# Altium schematic sheet Car_MCU.SchDoc: Wacky Vehicle MCU
size A3; DrawnBy: K. Carden, O. Anainga; Organization: Group 2; Address1: ECE Department; Address2: University of Canterbury; Address3: Christchurch 8041; Address4: New Zealand; Revision: 1; SheetNumber: 1; SheetTotal: 3; ImagePath: C:\Users\Public\Documents\Altium\AD23\Templates\UC_Templates\uc-logo.png
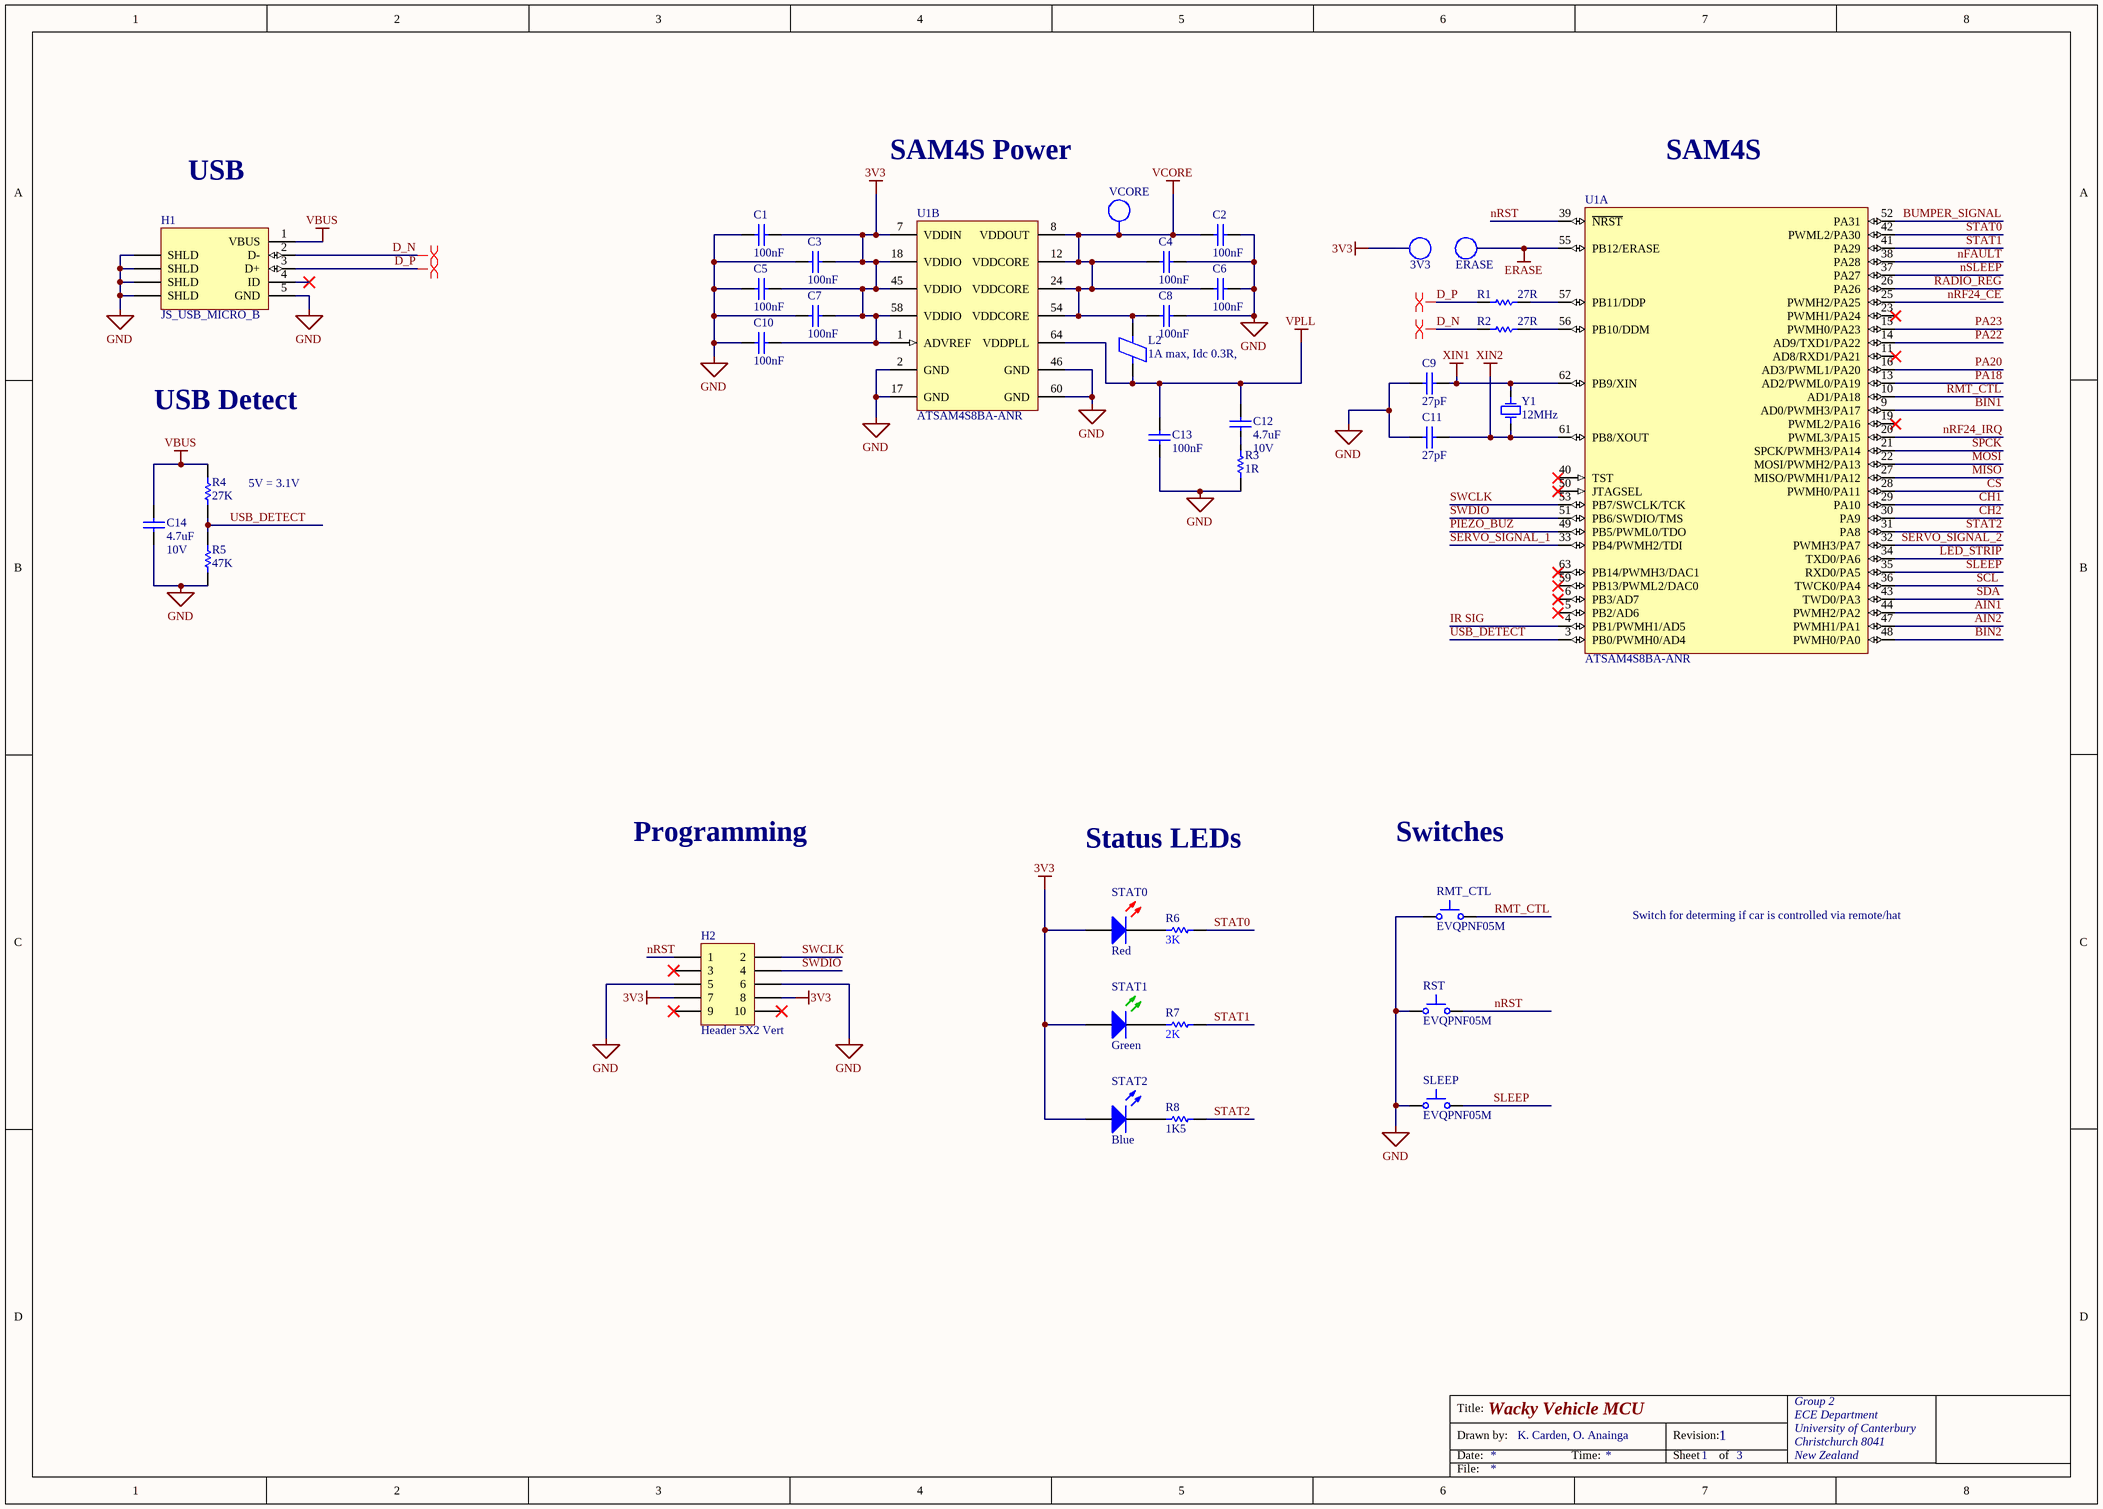
[diagram p0: Car_MCU.SchDoc]

## Parts
3V3  TP_0805  [TP_0805]  (value not drawn)
C1  100nF  [CAPC1608L]
C2  100nF  [CAPC1608L]
C3  100nF  [CAPC1608L]
C4  100nF  [CAPC1608L]
C5  100nF  [CAPC1608L]
C6  100nF  [CAPC1608L]
C7  100nF  [CAPC1608L]
C8  100nF  [CAPC1608L]
C9  27pF  [CAPC1608L]
C10  100nF  [CAPC1608L]
C11  27pF  [CAPC1608L]
C12  Max Voltage: 10V  [CAPC1608N]  (hidden comment: 4.7uF)
C13  100nF  [CAPC1608L]
C14  Max Voltage: 10V  [CAPC1608N]  (hidden comment: 4.7uF)
ERASE  TP_0805  [TP_0805]  (value not drawn)
H1  JS_USB_MICRO_B  [FCI_USB_10118194-0001LF]
H2  Header 5X2 Vert  [IDC2.54-V10D]
L2  1A max, Idc 0.3R,  [INDC3216L]
R1  27R  [RESC1608L]
R2  27R  [RESC1608L]
R3  1R  [RESC3216L]
R4  27K  [RESC1608L]
R5  47K  [RESC1608L]
R6  3K  [RESC1608L]
R7  2K  [RESC1608L]
R8  1K5  [RESC1608L]
RMT_CTL  EVQPNF05M  [EVQPNF05M]
RST  EVQPNF05M  [EVQPNF05M]
SLEEP  EVQPNF05M  [EVQPNF05M]
STAT0  Red  [WL-SMCW0603]
STAT1  Green  [WL-SMCW0603]
STAT2  Blue  [WL-SMCW0603]
U1  ATSAM4S8BA-ANR  [LQFP64_L]  (parts A,B of 2)
VCORE  VCORE  [TP_1206]  (value not drawn)  (no BOM)
Y1  12MHz  [6.0X3.5-4]

## Nets
3V3: 3V3.1(TP) C1.2 C3.2 C5.2 C7.2 C10.2 H2.7 H2.8 STAT0.2(A) STAT1.2(A) STAT2.2(A) U1.1(ADVREF) U1.7(VDDIN) U1.18(VDDIO) U1.45(VDDIO) U1.58(VDDIO)
ERASE: ERASE.1(TP) U1.55(PB12/ERASE)
GND: C1.1 C2.2 C3.1 C4.2 C5.1 C6.2 C7.1 C8.2 C9.1 C10.1 C11.1 C13.1 C14.1 H1.5(GND) H1.6(SHLD) H2.5 H2.6 R3.1 R5.1 RMT_CTL.1 RST.1 SLEEP.1 U1.2(GND) U1.17(GND) U1.46(GND) U1.60(GND)
VBUS: C14.2 H1.1(VBUS) R4.2
VCORE: C2.1 C4.1 C6.1 C8.1 L2.2 U1.8(VDDOUT) U1.12(VDDCORE) U1.24(VDDCORE) U1.54(VDDCORE) VCORE.1
VPLL: C12.2 C13.2 L2.1 U1.64(VDDPLL)
XIN1: C9.2 U1.62(PB9/XIN) Y1.3(OSC2)
XIN2: C11.2 U1.61(PB8/XOUT) Y1.1(OSC1)
AIN1: U1.44(PWMH2/PA2)
AIN2: U1.47(PWMH1/PA1)
BIN1: U1.9(AD0/PWMH3/PA17)
BIN2: U1.48(PWMH0/PA0)
BUMPER_SIGNAL: U1.52(PA31)
CH1: U1.29(PA10)
CH2: U1.30(PA9)
CS: U1.28(PWMH0/PA11)
D_N: H1.2(D-) R2.1
D_P: H1.3(D+) R1.1
IR SIG: U1.4(PB1/PWMH1/AD5)
LED_STRIP: U1.34(TXD0/PA6)
MISO: U1.27(MISO/PWMH1/PA12)
MOSI: U1.22(MOSI/PWMH2/PA13)
nFAULT: U1.38(PA28)
nRF24_CE: U1.25(PWMH2/PA25)
nRF24_IRQ: U1.20(PWML3/PA15)
nRST: H2.1 RST.2 U1.39(~{NRST})
nSLEEP: U1.37(PA27)
PA18: U1.13(AD2/PWML0/PA19)
PA20: U1.16(AD3/PWML1/PA20)
PA22: U1.14(AD9/TXD1/PA22)
PA23: U1.15(PWMH0/PA23)
PIEZO_BUZ: U1.49(PB5/PWML0/TDO)
RADIO_REG: U1.26(PA26)
RMT_CTL: RMT_CTL.2 U1.10(AD1/PA18)
SCL: U1.36(TWCK0/PA4)
SDA: U1.43(TWD0/PA3)
SERVO_SIGNAL_1: U1.33(PB4/PWMH2/TDI)
SERVO_SIGNAL_2: U1.32(PWMH3/PA7)
SLEEP: SLEEP.2 U1.35(RXD0/PA5)
SPCK: U1.21(SPCK/PWMH3/PA14)
STAT0: R6.2 U1.42(PWML2/PA30)
STAT1: R7.2 U1.41(PA29)
STAT2: R8.2 U1.31(PA8)
SWCLK: H2.2 U1.53(PB7/SWCLK/TCK)
SWDIO: H2.4 U1.51(PB6/SWDIO/TMS)
USB_DETECT: R4.1 R5.2 U1.3(PB0/PWMH0/AD4)
NetC12_1: C12.1 R3.2
NetR1_2: R1.2 U1.57(PB11/DDP)
NetR2_2: R2.2 U1.56(PB10/DDM)
NetR6_1: R6.1 STAT0.1(K)
NetR7_1: R7.1 STAT1.1(K)
NetR8_1: R8.1 STAT2.1(K)

Not connected (* = marked no-connect by the designer): H1 4(ID)*; H2 3* 9* 10*; U1 5(PB2/AD6)* 6(PB3/AD7)* 11(AD8/RXD1/PA21)* 19(PWML2/PA16)* 23(PWMH1/PA24)* 40(TST)* 50(JTAGSEL)* 59(PB13/PWML2/DAC0)* 63(PB14/PWMH3/DAC1)*

## Layout directives
differential pair: D_N, D_P

## Notes on the sheet
- USB
- SAM4S Power
- SAM4S
- USB Detect
- (near R4) 5V = 3.1V
- Programming
- Status LEDs
- Switches
- Switch for determing if car is controlled via remote/hat
- Title:
- Drawn by:
- Date:
- Time:
- Revision:
- Sheet
- of
- File:

## Library data of the parts
3V3 ERASE = TP_0805: Test Point 2.0X0.9X1.2mm SMD; Manufacturer: TE Connectivity AMP Connectors; Manufacturer Part Number: 1625854-2; Supplier 1: Digi-Key; Mounting Type: Surface Mount; Terminal: 0.079" x 0.049" x 0.057" (2.00mm x 1.25mm x 1.45mm); Type: PC Test Point; Supplier Part Number 1: A106144CT-ND
C1-C8 C10 C13 = CC_100nF_0603: CAP CER 100nF X7R +-10% 50V 0603; PackageReference: 0603; Code_IPC: 1608 [0603]; Verify: *; Supplier: ECE Dept; Storage Location: PCB Assembly WS; Value: 100nF
C9 C11 = CC_27pF_0603: CAP CER 27pF NPO/COG +-5% 50V 0603; PackageReference: 0603; Code_IPC: 1608 [0603]; Verify: *; Supplier: ECE Dept; Storage Location: PCB Assembly WS; Value: 27pF
C12 C14 = CC_4.7uF_0603: CAP CER 4.7uF X5R +-20%  10V 0603; Note: Footprint corresponds to dimensions for bulk cassette packaging. This case size has tightened tolerances.; PackageReference: 0805; Code_IPC: 2012[0805]; Verify: *; Supplier: ECE Dept; Storage Location: PCB Assembly WS; Value: 4.7uF
H1 = JS_USB_MICRO_B_SMT: CONN USB MICRO B RECPT SMT R/A; Manufacturer: FCI; Manufacturer Part Number: 10118194-0001LF; Gender: Receptacle; Number of Contacts: 5; Specifications: USB 2.0; Supplier 1: Digi-Key; Supplier Part Number 1: 609-4618-1-ND; Features: Shielded, Solder Retention; Mounting Type: Surface Mount, Right Angle, Horizontal
H2 = JA_HDR_IDC_5X2_VERT: IDC Header, 2,54mm, 10-Pin, Vert; Supplier: ECE Dept; Supplier 1: Farnell; Supplier Part Number 1: 1096985; Storage Location: ECE Dept Store
L2 = IN_Ferrite-Bead: Ferrite Bead, Rdc 0.3R, Z100MHZ 600R, Imax 1A, SMD 1206; Manufacturer: FAIR-RITE; Manufacturer PN: 2512066017Y1; DC Current Rating: 1; DC Resistance Max: 0.08; Ferrite Case Style: 1206 ^3216 Metric]; Frequency Range: 50MHz to 1; Impedance: 600; Impedance Tolerance: ± 25%; Supplier: ECE Dept; Storage Location: PCB Assembly WS; Ferrite Mounting: SMD; Supplier 1: Farnell; Supplier Part Number 1: 1612060; Manufacturer Part Number: 2512066017Y1; Value: 1A max, Idc 0.3R,
R1 R2 = RS_27R: RES 27 OHM 1/10W 5% 0603 SMD; Storage Location: PCB Assembly WS; Supplier: ECE Dept; Value: 27R
R3 = RT_1R: RES 1R OHM 1/4W 5% 1206 SMD; Storage Location: PCB Assembly WS; Supplier: ECE Dept; Value: 1R
R4 = RS_27K: RES 27K OHM 1/10W 5% 0603 SMD; Storage Location: PCB Assembly WS; Supplier: ECE Dept; Value: 27K
R5 = RS_47K: RES 47.0K OHM 1/10W 5% 0603 SMD; Storage Location: PCB Assembly WS; Supplier: ECE Dept; Value: 47K
R6 = RS_3K: RES 3K OHM 1/10W 5% 0603 SMD; Storage Location: PCB Assembly WS; Supplier: ECE Dept; Value: 3K
R7 = RS_2K: RES 2K OHM 1/10W 5% 0603 SMD; Storage Location: PCB Assembly WS; Supplier: ECE Dept; Value: 2K
R8 = RS_1K5: RES 1.5K OHM 1/10W 5% 0603 SMD; Storage Location: PCB Assembly WS; Supplier: ECE Dept; Value: 1K5
RMT_CTL RST SLEEP = WS_EVQPNF05M: Panasonic 6 x 3.5mm SMD Light Touch Switch Type SMD; PackageDescription: 6.0 x 3.5 mm; Supplier 1: Farnell; Supplier Part Number 1: 2079481; Manufacturer: Panasonic; Manufacturer PN: EVQPNF05M; Supplier 2: Digi-Key; Supplier Part Number 2: P13598SCT-ND; Storage Location: PCB Assembly WS; Supplier: ECE Dept
STAT0 = DL_150060RS75000: LED Red 250mcd 0603 SMD; Manufacturer: WURTH ELEKTRONIK; Forward Current If: 30; Forward Voltage: 2; Lens Shape: Rectangular; Luminous Intensity: 250; Wavelength Typ: 625; Viewing Angle: 140°; LED Mounting: SMD; Supplier 1: Farnell; Supplier Part Number 1: 2322071; Manufacturer Part Number: 150060RS75000; Storage Location: PCB Assembly WS; Supplier: ECE Dept; LED Colour: Red
STAT1 = DL_150060GS75000: LED Green 430mcd 0603 SMD; Manufacturer: WURTH ELEKTRONIK; Forward Current If: 30; Wavelength Typ: 520; Forward Voltage: 3.2; Lens Shape: Rectangular; Luminous Intensity: 430; Viewing Angle: 140°; LED Mounting: SMD; Supplier 1: Farnell; Supplier Part Number 1: 2322070; Manufacturer Part Number: 150060GS75000; Storage Location: PCB Assembly WS; Supplier: ECE Dept; LED Colour: Green
STAT2 = DL_150060BS75000: LED Blue 270mcd 0603 SMD; Manufacturer: WURTH ELEKTRONIK; Forward Current If: 30; Forward Voltage: 3.2; Luminous Intensity: 270; Viewing Angle: 120°; Wavelength Typ: 470; Pricing: 1=0.3844, 50=0.3252, 100=0.2957, 500=0.2365 (NZD); Supplier 1: Farnell; Supplier Part Number 1: 2322069; Manufacturer Part Number: 150060BS75000; Storage Location: PCB Assembly WS; Supplier: ECE Dept; LED Colour: Blue
U1 = SE_ATSAM4S16BA-MU: IC MCU 32BIT 512KB FLASH 64LQFP; Manufacturer: Atmel; Connectivity: I²C, IrDA, Memory Card, SPI, SSC, UART/USART, USB; Core Processor: ARM® Cortex®-M4; Core Size: 32-Bit; Data Converters: A/D 11x12b, D/A 2x12b; Number of I/O: 47; Peripherals: Brown-out Detect/Reset, DMA, POR, PWM, WDT; Program Memory Size: 512KB (512K x 8); RAM Size: 128K x 8; Speed: 120MHz; Voltage - Supply (Vcc/Vdd): 1.62 V ~ 3.6 V; PackageVersion: revJ, Jul-2007; PackageReference: 64PS; PackageDescription: 64-Pin Quad Flat No-Lead (QFN) Sawn, 9 x 9 x 1.0 mm Body, 0.5 mm Pitch, Exposed Pad; Code_JEDEC: MO-220VMMD-3; ComponentLink1Description: Manufacturer URL; ComponentLink1URL: http://www.atmel.com/; ComponentLink2Description: SAM4S Series Datasheet; ComponentLink2URL: http://www.atmel.com/dyn/resources/prod_documents/11100.pdf; ComponentLink3Description: SAM4S Series Summary; ComponentLink3URL: http://www.atmel.com/dyn/resources/prod_documents/11100S.pdf; Supplier 1: Digi-Key; Package / Case: 64-LQFP; Packaging: Cut Tape (CT); Program Memory Type: FLASH; Supplier Part Number 1: ATSAM4S8BA-ANRCT-ND; Manufacturer Part Number: ATSAM4S8BA-ANR
VCORE = TP_1206: Test-Point 3.3x1.6x2.1mm SMD; Manufacturer: Harwin Inc; Manufacturer Part Number: S1751-46R; Value: TP; Manufacturer PN: *; Storage Location: ProtoPlace; Mounting Type: Surface Mount; Type: PC Test Point; Supplier 1: Digi-Key; Supplier Part Number 1: 952-1478-2-ND; Supplier 2: Farnell; Supplier Part Number 2: 1826282; Supplier: ECE Dept
Y1 = XT_CRYSTAL_12MHz_18pF: CRYSTAL 12MHZ 18PF 6X3.5mm SMD; Manufacturer: CTS-Frequency Controls; Manufacturer Part Number: 406C35D12M00000; ESR (Equivalent Series Resistance): 60 Ohm; Frequency Stability: ±50ppm; Frequency Tolerance: ±30ppm; Operating Mode: Fundamental; Supplier 1: Digi-Key; Height: 0.047" (1.20mm); Load Capacitance: 18pF; Mounting Type: Surface Mount; Operating Temperature: -20°C ~ 70°C; Package / Case: 4-SMD, No Lead (DFN, LCC); Size / Dimension: 0.236" L x 0.138" W (6.00mm x 3.50mm); Supplier Part Number 1: CTX855CT-ND; Frequency: 12MHz